# Altium schematic sheet main.SchDoc
size A4
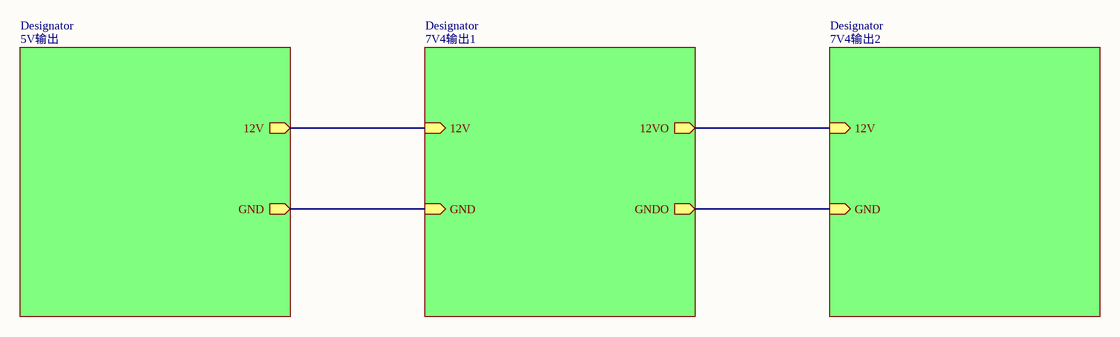
[diagram p0: main.SchDoc]

## Sub-sheets
Designator = 5V输出: 12V (out), GND (out)
Designator = 7V4输出1: 12V (in), GND (in), 12VO (out), GNDO (out)
Designator = 7V4输出2: 12V (in), GND (in)

## Nets
(unnamed): sheet Designator/12V, sheet Designator/12V
(unnamed): sheet Designator/GND, sheet Designator/GND
(unnamed): sheet Designator/12VO, sheet Designator/12V
(unnamed): sheet Designator/GNDO, sheet Designator/GND